# Altium schematic sheet Inputs_Outputs.SchDoc
size A4; SheetNumber: 4; SheetTotal: 4
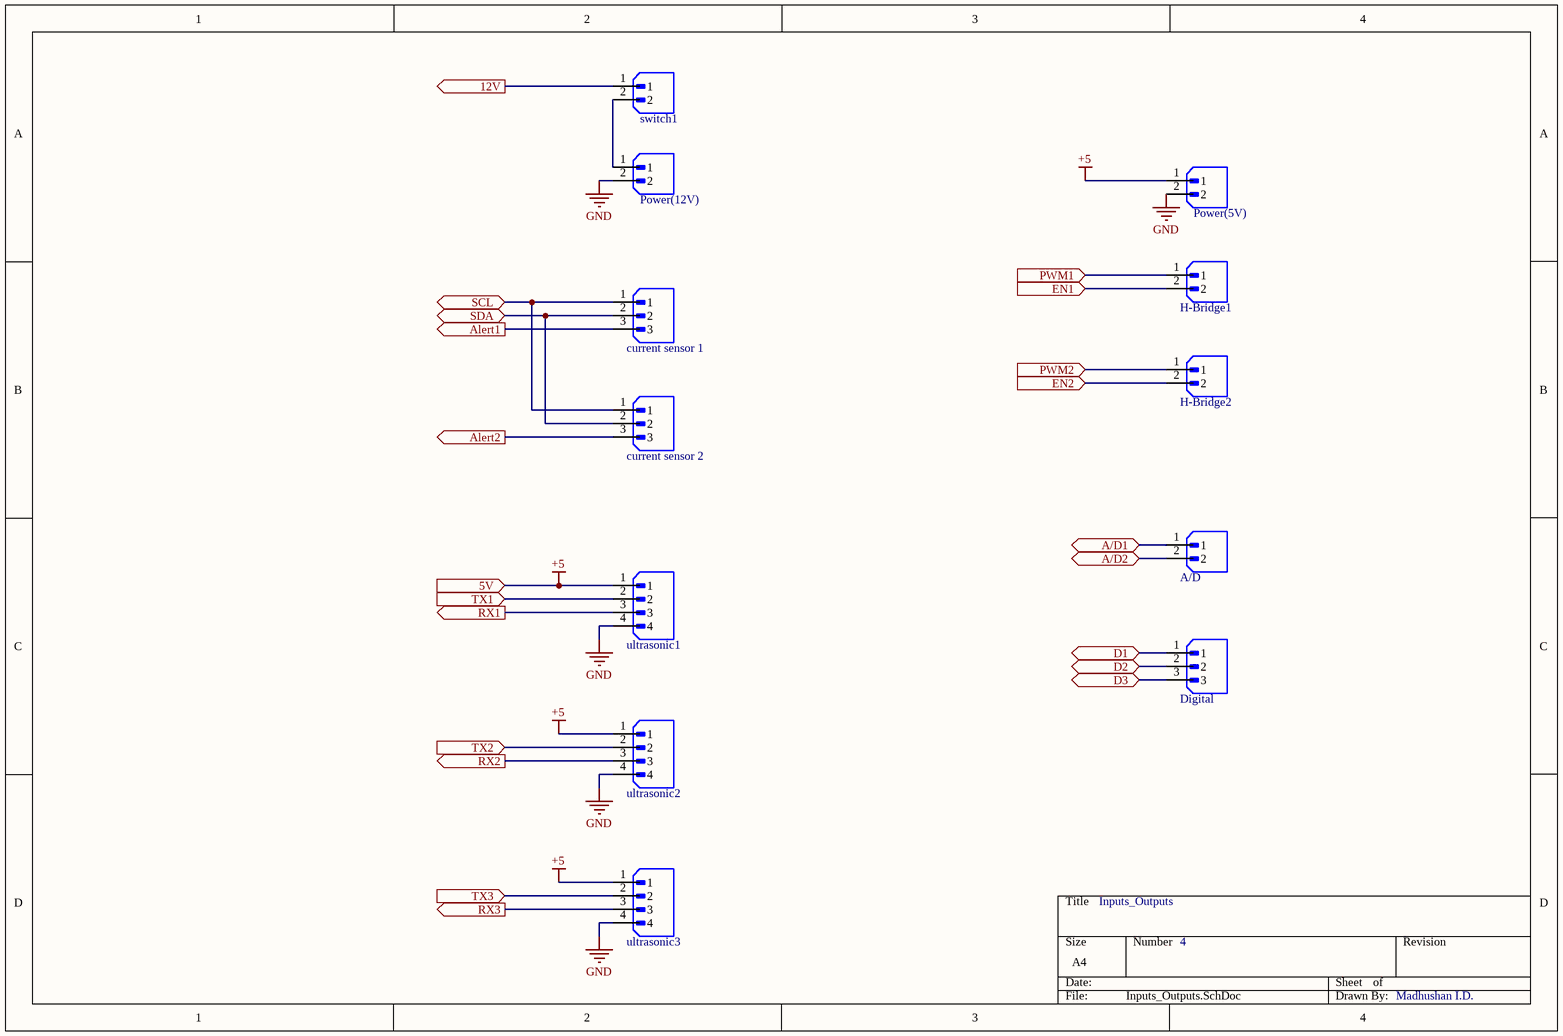
[diagram p0: Inputs_Outputs.SchDoc]

## Parts
A/D  B2B-XH-A  [JST_B2B-XH-A]  (value not drawn)
current_sensor_1  B3B-XH-A(LF)(SN)  [JST_B3B-XH-A(LF)(SN)]  (value not drawn)
current_sensor_2  B3B-XH-A(LF)(SN)  [JST_B3B-XH-A(LF)(SN)]  (value not drawn)
Digital  B3B-XH-A(LF)(SN)  [JST_B3B-XH-A(LF)(SN)]  (value not drawn)
H-Bridge1  B2B-XH-A  [JST_B2B-XH-A]  (value not drawn)
H-Bridge2  B2B-XH-A  [JST_B2B-XH-A]  (value not drawn)
Power(5V)  B2B-XH-A  [JST_B2B-XH-A]  (value not drawn)
Power(12V)  B2B-XH-A  [JST_B2B-XH-A]  (value not drawn)
switch1  B2B-XH-A  [JST_B2B-XH-A]  (value not drawn)
ultrasonic1  B4B-XH-A(LF)(SN)  [JST_B4B-XH-A(LF)(SN)]  (value not drawn)
ultrasonic2  B4B-XH-A(LF)(SN)  [JST_B4B-XH-A(LF)(SN)]  (value not drawn)
ultrasonic3  B4B-XH-A(LF)(SN)  [JST_B4B-XH-A(LF)(SN)]  (value not drawn)

## Ports
5V (in, see Hierarchy[2C], Atmega328p-AU[2B], powerSupply[3B]), 12V (out, see Hierarchy[2D], powerSupply[1B]), A/D1 (bidir, see Hierarchy[3D], Atmega328p-AU[3C]), A/D2 (bidir, see Hierarchy[3D], Atmega328p-AU[3C]), Alert1 (out, see Hierarchy[2D], Atmega328p-AU[2D]), Alert2 (out, see Hierarchy[2D], Atmega328p-AU[2D]), D1 (bidir, see Hierarchy[3D], Atmega328p-AU[2D]), D2 (bidir, see Hierarchy[3D], Atmega328p-AU[3D]), D3 (bidir, see Hierarchy[3D], Atmega328p-AU[2B]), EN1 (in, see Hierarchy[3C], Atmega328p-AU[1C]), EN2 (in, see Hierarchy[3C], Atmega328p-AU[2D]), PWM1 (in, see Hierarchy[3C], Atmega328p-AU[1B]), PWM2 (in, see Hierarchy[3C], Atmega328p-AU[2D]), RX1 (out, see Hierarchy[2C], Atmega328p-AU[3C]), RX2 (out, see Hierarchy[2C], Atmega328p-AU[3B]), RX3 (out, see Hierarchy[2C], Atmega328p-AU[2B]), SCL (bidir, see Hierarchy[2D], Atmega328p-AU[2B]), SDA (bidir, see Hierarchy[2D], Atmega328p-AU[3B]), TX1 (in, see Hierarchy[3C], Atmega328p-AU[3B]), TX2 (in, see Hierarchy[3C], Atmega328p-AU[3B]), TX3 (in, see Hierarchy[3C], Atmega328p-AU[2B])

## Nets
+5: Power(5V).1 ultrasonic1.1 ultrasonic2.1 ultrasonic3.1 ; port 5V
GND: Power(5V).2 Power(12V).2 ultrasonic1.4 ultrasonic2.4 ultrasonic3.4
12V: switch1.1 ; port 12V
A/D1: A/D.1 ; port A/D1
A/D2: A/D.2 ; port A/D2
Alert1: current_sensor_1.3 ; port Alert1
Alert2: current_sensor_2.3 ; port Alert2
D1: Digital.1 ; port D1
D2: Digital.2 ; port D2
D3: Digital.3 ; port D3
EN1: H-Bridge1.2 ; port EN1
EN2: H-Bridge2.2 ; port EN2
PWM1: H-Bridge1.1 ; port PWM1
PWM2: H-Bridge2.1 ; port PWM2
RX1: ultrasonic1.3 ; port RX1
RX2: ultrasonic2.3 ; port RX2
RX3: ultrasonic3.3 ; port RX3
SCL: current_sensor_1.1 current_sensor_2.1 ; port SCL
SDA: current_sensor_1.2 current_sensor_2.2 ; port SDA
TX1: ultrasonic1.2 ; port TX1
TX2: ultrasonic2.2 ; port TX2
TX3: ultrasonic3.2 ; port TX3
NetPower(12V)_1: Power(12V).1 switch1.2

## Notes on the sheet
- Inputs_Outputs
- 4
- Madhushan I.D.

## Library data of the parts
A/D H-Bridge1 H-Bridge2 Power(5V) Power(12V) switch1 = B2B-XH-A: MF: {'manufacturer': u'JST Sales America Inc.'}; Package: None; Price: None; Value: *; MP: B2B-XH-A; Availability: Unavailable
current_sensor_1 current_sensor_2 Digital = B3B-XH-A(LF)(SN): Connector Header Through Hole 3 position 0.098 (2.50mm); MF: JST Sales; SnapEDA_Link: https://www.snapeda.com/parts/B3B-XH-A(LF)(SN)/JST+Sales+America+Inc./view-part/?ref=snap; Package: None; Value: *; MP: B3B-XH-A(LF)(SN); Check_prices: https://www.snapeda.com/parts/B3B-XH-A(LF)(SN)/JST+Sales+America+Inc./view-part/?ref=eda
ultrasonic1-ultrasonic3 = B4B-XH-A(LF)(SN): Connector Header Through Hole 4 position 0.098 (2.50mm); MF: JST Sales; SnapEDA_Link: https://www.snapeda.com/parts/B4B-XH-A(LF)(SN)/JST+Sales+America+Inc./view-part/?ref=snap; Package: None; Value: *; MP: B4B-XH-A(LF)(SN); Check_prices: https://www.snapeda.com/parts/B4B-XH-A(LF)(SN)/JST+Sales+America+Inc./view-part/?ref=eda